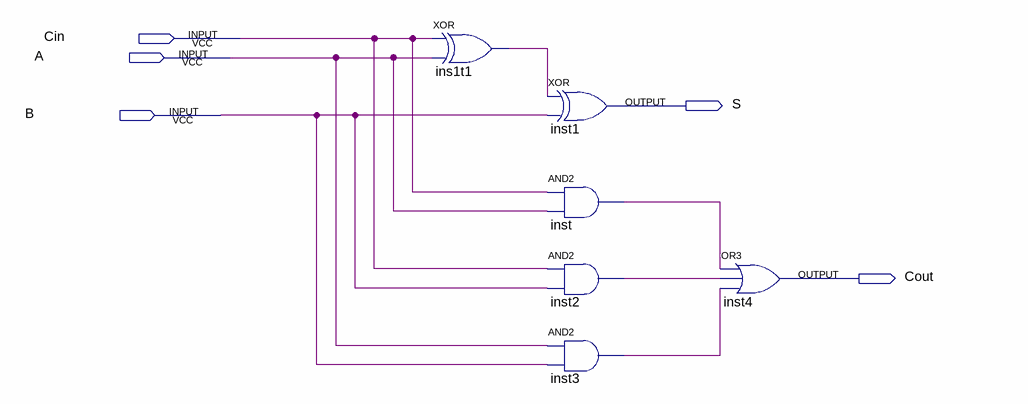
[diagram p0: schematic sheet]
// Quartus schematic FA1BIT.bdf as structural Verilog: 6 symbols, 5 pins
module FA1BIT (
  input  Cin,
  input  A,
  input  B,
  output S,
  output Cout
);

  wire ins1t1_out, inst2_out, inst3_out, inst_out;

  xor ins1t1 (ins1t1_out, Cin, A);
  xor inst1 (S, ins1t1_out, B);
  and inst (inst_out, Cin, A);
  and inst2 (inst2_out, Cin, B);
  and inst3 (inst3_out, A, B);
  or inst4 (Cout, inst_out, inst2_out, inst3_out);
endmodule
